# EAGLE design untitled (EAGLE 8.3.1)
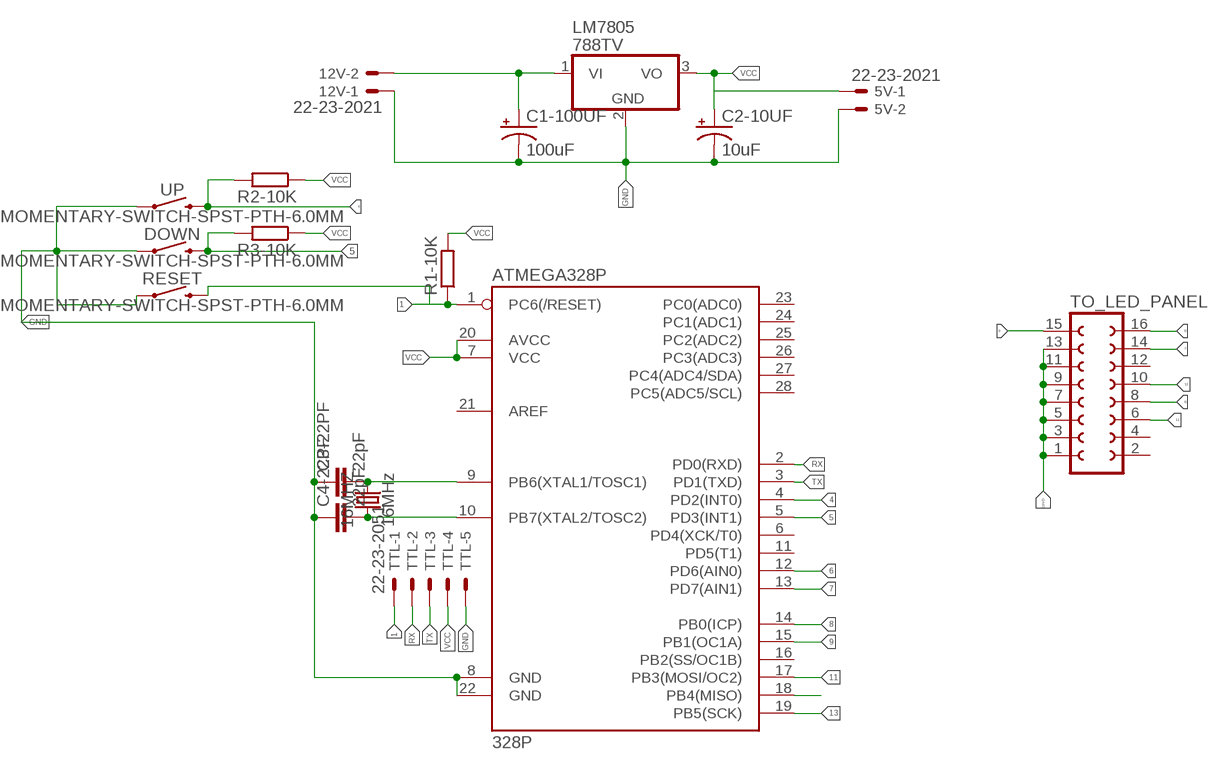
[diagram p0: schematic, sheet 1]

## Parts
5V  22-23-2021  [22-23-2021]
12V  22-23-2021  [22-23-2021]
16MHZ  16MHz  CRYSTAL-16MHZPTH-HC49US  [HC49US]
ATMEGA328P  328P  ATMEGA328P_PDIP  [DIP28]
C1-100UF  100uF  100UF-POLAR-RADIAL-2.5MM-25V-20%  [CPOL-RADIAL-2.5MM-6.5MM]
C2-10UF  10uF  10UF-POLAR-RADIAL-2.5MM-25V-20%  [CPOL-RADIAL-2.5MM-5MM]
C3-22PF  22pF  22PF-PTH-2.54MM-200V-5%  [CAP-PTH-2.54]
C4-22PF  22pF  22PF-PTH-2.54MM-200V-5%  [CAP-PTH-2.54]
DOWN  MOMENTARY-SWITCH-SPST-PTH-6.0MM  [TACTILE_SWITCH_PTH_6.0MM]
LM7805  788TV  [TO220V]
R1-10K  R-EU_0207/10  [0207/10]
R2-10K  R-EU_0207/10  [0207/10]
R3-10K  R-EU_0207/10  [0207/10]
RESET  MOMENTARY-SWITCH-SPST-PTH-6.0MM  [TACTILE_SWITCH_PTH_6.0MM]
TO_LED_PANEL  FE08-2  [FE08-2]
TTL  22-23-2051  [22-23-2051]
UP  MOMENTARY-SWITCH-SPST-PTH-6.0MM  [TACTILE_SWITCH_PTH_6.0MM]

## Nets
1: ATMEGA328P.1(PC6(/RESET)) R1-10K.1 RESET.3 TTL.1
4: ATMEGA328P.4(PD2(INT0)) R2-10K.2 UP.3
5: ATMEGA328P.5(PD3(INT1)) DOWN.3 R3-10K.2
6: ATMEGA328P.12(PD6(AIN0)) TO_LED_PANEL.16
7: ATMEGA328P.13(PD7(AIN1)) TO_LED_PANEL.14
8: ATMEGA328P.14(PB0(ICP)) TO_LED_PANEL.8
9: ATMEGA328P.15(PB1(OC1A)) TO_LED_PANEL.15
11: ATMEGA328P.17(PB3(MOSI/OC2)) TO_LED_PANEL.6
13: ATMEGA328P.19(PB5(SCK)) TO_LED_PANEL.10
GND: 5V.2 12V.1 ATMEGA328P.8(GND) ATMEGA328P.22(GND) C1-100UF.2(-) C2-10UF.2(-) C3-22PF.1 C4-22PF.1 DOWN.1 LM7805.2(GND) RESET.1 TO_LED_PANEL.1 TO_LED_PANEL.3 TO_LED_PANEL.5 TO_LED_PANEL.7 TO_LED_PANEL.9 TO_LED_PANEL.11 TO_LED_PANEL.13 TTL.5 UP.1
N$1: 16MHZ.2 ATMEGA328P.9(PB6(XTAL1/TOSC1)) C3-22PF.2
N$2: 16MHZ.1 ATMEGA328P.10(PB7(XTAL2/TOSC2)) C4-22PF.2
N$6: ATMEGA328P.18(PB4(MISO))
RX: ATMEGA328P.2(PD0(RXD)) TTL.2
TX: ATMEGA328P.3(PD1(TXD)) TTL.3
VCC: 5V.1 ATMEGA328P.7(VCC) ATMEGA328P.20(AVCC) C2-10UF.1(+) LM7805.3(VO) R1-10K.2 R2-10K.1 R3-10K.1 TTL.4
VIN: 12V.2 C1-100UF.1(+) LM7805.1(VI)
Unconnected: ATMEGA328P.6(PD4(XCK/T0)) ATMEGA328P.11(PD5(T1)) ATMEGA328P.16(PB2(SS/OC1B)) ATMEGA328P.21(AREF) ATMEGA328P.23(PC0(ADC0)) ATMEGA328P.24(PC1(ADC1)) ATMEGA328P.25(PC2(ADC2)) ATMEGA328P.26(PC3(ADC3)) ATMEGA328P.27(PC4(ADC4/SDA)) ATMEGA328P.28(PC5(ADC5/SCL)) TO_LED_PANEL.2 TO_LED_PANEL.4 TO_LED_PANEL.12

## Library data of the parts
5V 12V = con-molex:22-23-2021: .100" (2.54mm) Center Header - 2 Pin
16MHZ = SparkFun-Clocks:CRYSTAL-16MHZ: 16MHz Crystal Digikey Example <http://www.digikey.com/product-search/en?keywords=535-9122-1-ND> Frequency: 16MHz Frequency Stability: ±50ppm Frequency Tolerance: ±20ppm Load Capacitance: 18pF SparkFun Products: Pro Micro -5V/16MHz <https://www.sparkfun.com/products/12640> SparkFun Serial Enabled LCD Kit <https://www.sparkfun.com/products/10097>; PROD_ID: XTAL-08181; SF_ID: COM-00536
ATMEGA328P = SparkFun-IC-Microcontroller:ATMEGA328P_PDIP: Atmel 328P Through hole ATMEGA328P uC used in the Arduino 32kb flash, 1k EEPROM, 2k SRAM Datasheet <http://www.sparkfun.com/datasheets/Components/SMD/ATMega328.pdf> SparkFun Products Storefront component: AVR 28 Pin 20MHz 32K 6A/D - ATMega328P <https://www.sparkfun.com/products/9061> (COM-09061) SparkFun Simon Says - Through-Hole Soldering Kit <https://www.sparkfun.com/products/10547> (KIT-10547) SparkFun Learn to Solder - Simon Says <https://www.sparkfun.com/products/13708> (KIT-13708) SparkFun BigTime Watch Kit <https://www.sparkfun.com/products/11734> (KIT-11734) SparkFun ClockIt <https://www.sparkfun.com/products/10930> (KIT-10930) SparkFun Serial Enabled LCD Kit <https://www.sparkfun.com/products/10097> (LCD-10097) SparkFun Simon Tilts - Through Hole Soldering Kit <https://www.sparkfun.com/products/12634> (KIT-12634) SparkFun Frequency Counter Kit <https://www.sparkfun.com/products/10140> (KIT-10140) FabFM Radio Kit <https://www.sparkfun.com/products/11043> (KIT-11043) SparkFun Binary Blaster Kit <https://www.sparkfun.com/products/12037> (KIT-12037) SparkFun Metro-Gnome <https://www.sparkfun.com/products/9236> (KIT-09236) ATmega328 with Arduino Optiboot (Uno) <https://www.sparkfun.com/products/10524> (DEV-10524); PROD_ID: IC-09136
C1-100UF = SparkFun-Capacitors:100UF-POLAR: 100µF polarized capacitors A capacitor is a passive two-terminal electrical component used to store electrical energy temporarily in an electric field.; PROD_ID: CAP-08439
C2-10UF = SparkFun-Capacitors:10UF-POLAR: 10.0µF polarized capacitors A capacitor is a passive two-terminal electrical component used to store electrical energy temporarily in an electric field.; PROD_ID: CAP-08440
C3-22PF C4-22PF = SparkFun-Capacitors:22PF: 22pF ceramic capacitors A capacitor is a passive two-terminal electrical component used to store electrical energy temporarily in an electric field.; PROD_ID: CAP-09128
DOWN RESET UP = SparkFun-Switches:MOMENTARY-SWITCH-SPST: Momentary Switch (Pushbutton) - SPST Normally-open (NO) SPST momentary switches (buttons, pushbuttons). Variants PTH-12MM - 12mm square, through-hole Momentary Pushbutton Switch - 12mm Square <https://www.sparkfun.com/products/9190> (COM-09190) PTH-6.0MM, PTH-6.0MM-KIT - 6.0mm square, through-hole Mini Pushbutton Switch <https://www.sparkfun.com/products/97> (COM-00097) KIT package intended for soldering kit's - only one side of pads' copper is exposed. PTH-RIGHT-ANGLE-KIT - Right-angle, through-hole Right Angle Tactile Button <https://www.sparkfun.com/products/10791> - Used on SparkFun BigTime Watch Kit <https://www.sparkfun.com/products/11734> SMD-12MM - 12mm square, surface-mount Tactile Button - SMD (12mm) <https://www.sparkfun.com/products/12993> (COM-12993) Used on SparkFun PicoBoard <https://www.sparkfun.com/products/11888> SMD-4.5MM - 4.5mm Square Trackball Switch Used on SparkFun Blackberry Trackballer Breakout <https://www.sparkfun.com/products/13169> SMD-4.6MMX2.8MM - 4.60mm x 2.80mm, surface mount Used on SparkFun SAMD21 Mini Breakout <https://www.sparkfun.com/products/13664> SMD-5.2MM, SMD-5.2-REDUNDANT - 5.2mm square, surface-mount Mini Pushbutton Switch - SMD <https://www.sparkfun.com/products/8720> (COM-08720) Used on Arduino Pro Mini <https://www.sparkfun.com/products/11114> REDUNDANT package connects both switch circuits together SMD-6.0X3.5MM - 6.0 x 3.5mm, surface mount Momentary Reset Switch SMD <https://www.sparkfun.com/products/8229> (COM-08229) SMD-6.2MM-TALL - 6.2mm square, surface mount Tactile Button - SMD (6mm) <https://www.sparkfun.com/products/12992> Used on SparkFun Digital Sandbox <https://www.sparkfun.com/products/12651> SMD-RIGHT-ANGLE - Right-angle, surface mount Used on SparkFun Block for Intel® Edison - Arduino <https://www.sparkfun.com/products/13036>; PROD_ID: SWCH-08441; SF_SKU: COM-00097
LM7805 = linear:78*: Positive VOLTAGE REGULATOR Source: http://cache.national.com/ds/LM/LM78L05.pdf http://www.fairchildsemi.com/ds/LM/LM7805.pdf
R1-10K R2-10K R3-10K = rcl:R-EU_: RESISTOR, European symbol
TO_LED_PANEL = con-lsta:FE08-2: FEMALE HEADER
TTL = con-molex:22-23-2051: .100" (2.54mm) Center Header - 5 Pin

## Board
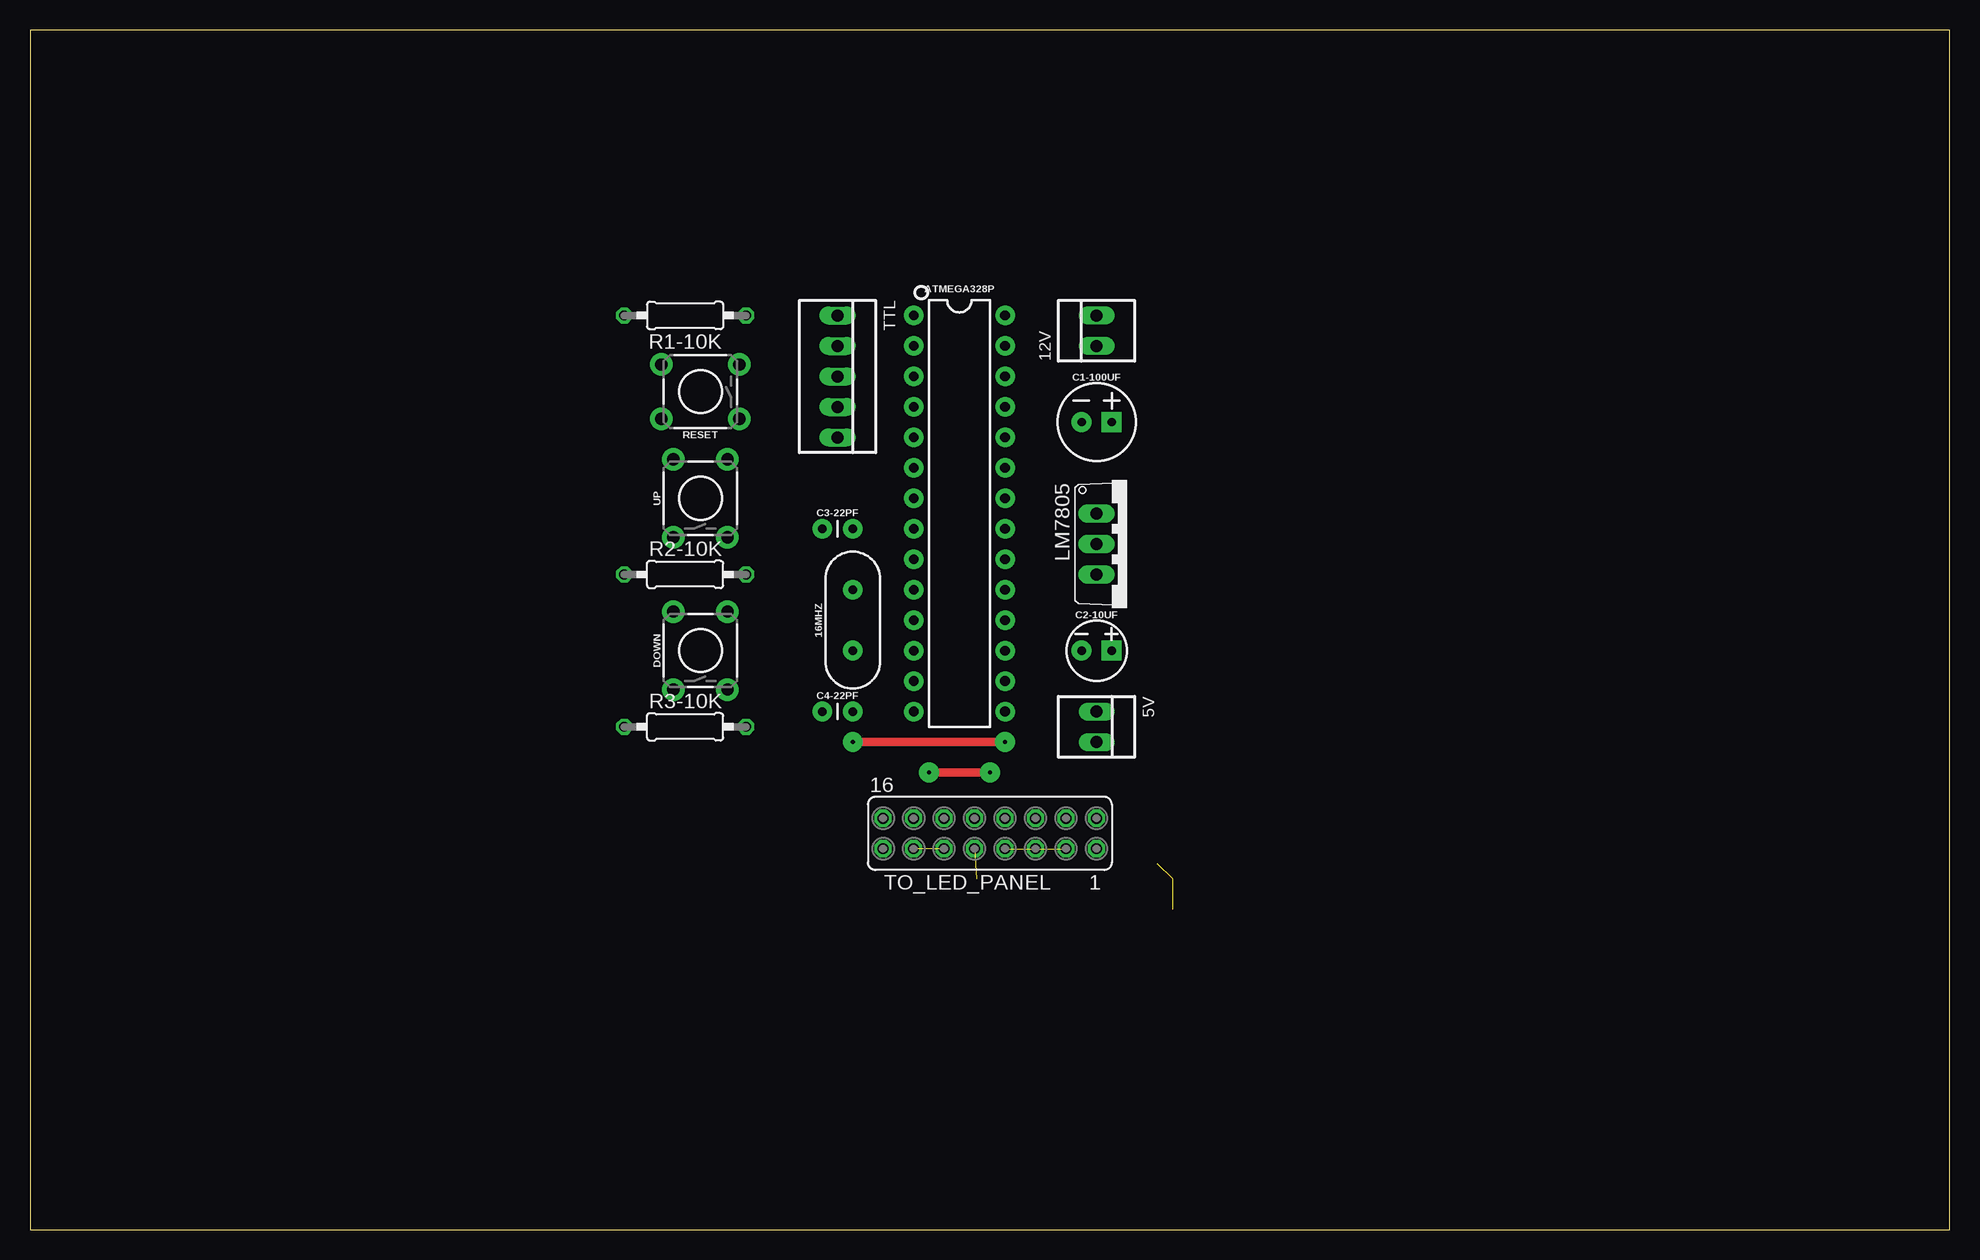
[diagram p1: board, top side]
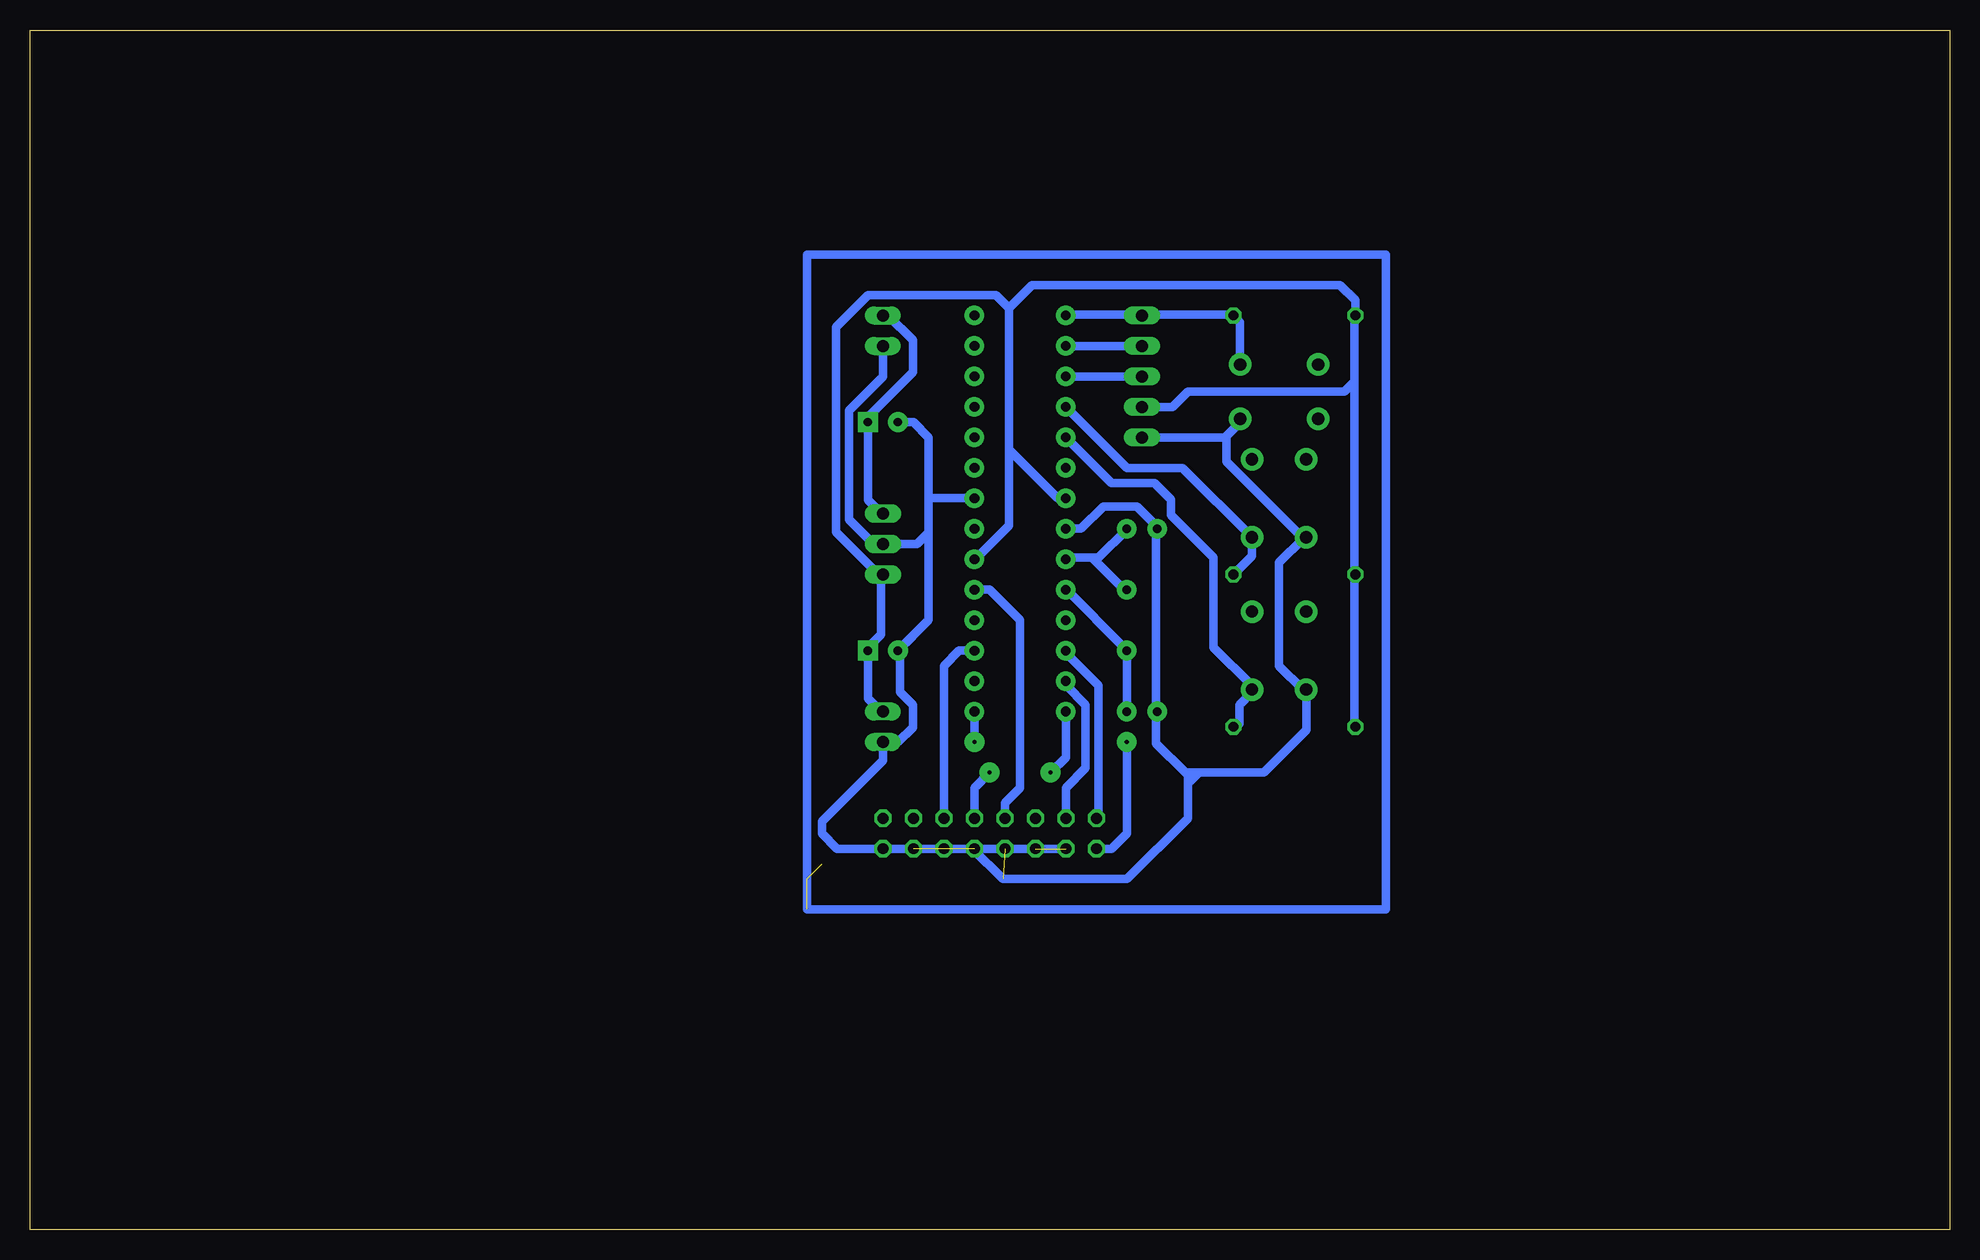
[diagram p2: board, bottom side, seen from below]

Size 160 x 100 mm. Coordinates in mm from the lower left corner, seen from the top.
Outline: 0,0 160,0 160,100 0,100 0,0
Copper layers (1*16): Top 0.035mm / dielectric 1.5mm / Bottom 0.035mm
Design rules "default *": minimum track width 28mil, minimum drill 0.35mm, track to track 14mil, track to pad 8mil, pad to pad 6mil, via to via 6mil, smd to smd 6mil, copper to edge 40mil, drill to drill 6mil, minimum pad ring 10mil, minimum via ring 8mil, stop-mask expansion 4mil, vias tented up to drill 0mil, thermal gap 10mil

### Footprints (pad centres in the part's own frame; a part is rotated, then mirrored left to right if it is on the bottom)
22-23-2021 = drill 1 long: 1 -1.27,0; 2 1.27,0
HC49US = drill 0.7 pad 1.651: 1 -2.54,0; 2 2.54,0
DIP28 = drill 0.813 pad 1.626: 1 -16.51,-3.81; 2 -13.97,-3.81; 3 -11.43,-3.81; 4 -8.89,-3.81; 5 -6.35,-3.81; 6 -3.81,-3.81; 7 -1.27,-3.81; 8 1.27,-3.81; 9 3.81,-3.81; 10 6.35,-3.81; 11 8.89,-3.81; 12 11.43,-3.81; 13 13.97,-3.81; 14 16.51,-3.81; 15 16.51,3.81; 16 13.97,3.81; 17 11.43,3.81; 18 8.89,3.81; 19 6.35,3.81; 20 3.81,3.81; 21 1.27,3.81; 22 -1.27,3.81; 23 -3.81,3.81; 24 -6.35,3.81; 25 -8.89,3.81; 26 -11.43,3.81; 27 -13.97,3.81; 28 -16.51,3.81
CPOL-RADIAL-2.5MM-6.5MM = drill 0.7 pad 1.651 square: 1 1.25,0 | drill 0.7 pad 1.651: 2 -1.25,0
CPOL-RADIAL-2.5MM-5MM = drill 0.7 pad 1.651 square: 1 1.25,0 | drill 0.7 pad 1.651: 2 -1.25,0
CAP-PTH-2.54 = drill 0.7 pad 1.651: 1 -1.27,0; 2 1.27,0
TACTILE_SWITCH_PTH_6.0MM = drill 1.016 pad 1.88: 1 -3.251,2.261; 2 3.251,2.261; 3 -3.251,-2.261; 4 3.251,-2.261
TO220V = drill 1.016 long: 1 -2.54,-2.54; 2 0,-2.54; 3 2.54,-2.54
0207/10 = drill 0.813 octagon: 1 -5.08,0; 2 5.08,0
FE08-2 = drill 0.914 octagon: 1 -8.89,1.27; 2 -8.89,-1.27; 3 -6.35,1.27; 4 -6.35,-1.27; 5 -3.81,1.27; 6 -3.81,-1.27; 7 -1.27,1.27; 8 -1.27,-1.27; 9 1.27,1.27; 10 1.27,-1.27; 11 3.81,1.27; 12 3.81,-1.27; 13 6.35,1.27; 14 6.35,-1.27; 15 8.89,1.27; 16 8.89,-1.27
22-23-2051 = drill 1 long: 1 -5.08,0; 2 -2.54,0; 3 0,0; 4 2.54,0; 5 5.08,0

### Placement (x,y rotation side)
5V  88.9,41.91 270 top
12V  88.9,74.93 90 top
16MHZ  68.58,50.8 90 top
ATMEGA328P  77.47,59.69 270 top
C1-100UF  88.9,67.31 0 top
C2-10UF  88.9,48.26 0 top
C3-22PF  67.31,58.42 0 top
C4-22PF  67.31,43.18 0 top
DOWN  55.88,48.26 90 top
LM7805  91.44,57.15 270 top
R1-10K  54.61,76.2 180 top
R2-10K  54.61,54.61 0 top
R3-10K  54.61,41.91 0 top
RESET  55.88,69.85 180 top
TO_LED_PANEL  80.01,33.02 180 top
TTL  67.31,71.12 270 top
UP  55.88,60.96 90 top

### Tracks (layer width: path | path; a pad name or v marks a point on that pad's centre or on a via)
1
  Bottom 0.711: ATMEGA328P.1 73.61,76.28 67.74,76.28 TTL.1 67.21,76.28 59.74,76.28 R1-10K.1 59.32,75.85 59.13,75.66 RESET.3
4
  Bottom 0.711: ATMEGA328P.4 68.58,63.5 63.93,63.5 UP.3 58.14,56.16 R2-10K.2
5
  Bottom 0.711: R3-10K.2 59.21,42.14 59.21,43.74 58.14,44.81 DOWN.3 58.14,45.34 61.34,48.54 61.34,56.01 64.9,59.56 64.9,60.85 66.28,62.23 69.85,62.23 ATMEGA328P.5
6
  Bottom 0.711: ATMEGA328P.12 73.66,48.06 70.94,45.34 70.94,34.47 TO_LED_PANEL.16
7
  Bottom 0.711: ATMEGA328P.13 73.61,45.34 72.01,43.74 72.01,38.48 73.66,36.83 TO_LED_PANEL.14
8  (via drill 0.35 pad 1.65)
  Top 0.711: v74.93,38.1 v80.01,38.1
  Bottom 0.711: TO_LED_PANEL.8 81.28,36.83 v80.01,38.1 | ATMEGA328P.14 73.66,39.37 v74.93,38.1
9  (via drill 0.35 pad 1.65)
  Top 0.711: v68.58,40.64 v81.28,40.64
  Bottom 0.711: TO_LED_PANEL.15 69.85,31.75 68.58,33.02 v68.58,40.64 | v81.28,40.64 ATMEGA328P.15
11
  Bottom 0.711: ATMEGA328P.17 82.55,48.26 83.82,46.99 TO_LED_PANEL.6
13
  Bottom 0.711: ATMEGA328P.19 80.01,53.34 77.47,50.8 77.47,36.83 78.74,35.56 TO_LED_PANEL.10
GND  (5 unrouted)
  Bottom 0.711: 60.27,66.14 59.21,67.21 RESET.1 | 60.27,66.14 60.27,64.01 53.87,57.61 | 53.87,57.61 UP.1 | C2-10UF.2 87.48,48.01 87.48,44.81 86.41,43.74 86.41,41.86 87.63,40.64 5V.2 88.9,39.12 93.98,34.04 93.98,33.02 92.71,31.75 TO_LED_PANEL.1 81.43,31.75 | 88.54,57.07 LM7805.2 | 63.7,38.1 66.14,40.54 66.14,42.67 C4-22PF.1 66.14,43.2 66.14,58.14 C3-22PF.1 66.14,58.67 67.74,60.27 70.54,60.27 72.39,58.42 ATMEGA328P.8 | 62.58,38.1 57.15,38.1 53.62,41.63 DOWN.1 53.9,45.01 55.88,46.99 55.88,55.6 53.87,57.61 | 62.58,38.1 63.7,38.1 | TTL.5 60.38,66.04 60.27,66.14 | 12V.1 88.9,71.12 91.75,68.28 91.75,59.21 89.69,57.15 LM7805.2 | 63.5,37.18 63.5,34.29 68.58,29.21 78.89,29.21 81.43,31.75 | 63.5,37.18 63.5,37.9 63.7,38.1 | 62.58,38.1 63.5,37.18 | 81.43,31.75 TO_LED_PANEL.13 | 86.41,49.5 C2-10UF.2 | C1-100UF.2 86.36,67.31 85.09,66.04 85.09,60.96 | 85.09,60.96 ATMEGA328P.22 | 85.09,58.11 85.09,60.96 | 85.09,58.11 85.09,50.82 C2-10UF.2 | LM7805.2 86.05,57.15 85.09,58.11
N$1
  Bottom 0.711: 71.48,56.01 70.94,56.01 68.58,58.37 C3-22PF.2 | 71.48,56.01 73.61,56.01 ATMEGA328P.9 | 71.48,56.01 68.81,53.34 16MHZ.2
N$2
  Bottom 0.711: ATMEGA328P.10 73.61,53.34 68.81,48.54 16MHZ.1 C4-22PF.2
N$3  (2 unrouted)
  Bottom 0.711: 46.99,29.21 46.99,81.28 95.25,81.28 95.25,26.67 46.99,26.67 46.99,30.48
RX
  Bottom 0.711: TTL.2 ATMEGA328P.2
TX
  Bottom 0.711: TTL.3 ATMEGA328P.3
VCC
  Bottom 0.711: 5V.1 89.08,43.2 90.14,44.27 90.14,48.01 C2-10UF.1 90.14,48.54 89.08,49.61 89.08,54.41 LM7805.3 89.28,54.61 92.81,58.14 92.81,75.21 90.14,77.88 79.48,77.88 78.41,76.81 | R3-10K.1 49.61,42.14 49.61,54.41 R2-10K.1 49.61,54.94 49.61,70.7 | 49.61,70.7 49.61,75.74 R1-10K.2 49.53,77.47 50.8,78.74 76.48,78.74 78.41,76.81 | 78.41,76.81 78.41,65.02 | 78.41,65.02 78.41,58.67 81.08,56.01 ATMEGA328P.20 | TTL.4 64.77,68.58 63.5,69.85 58.42,69.85 | 57.92,69.85 58.42,69.85 | 58.42,69.85 50.45,69.85 49.61,70.7 | ATMEGA328P.7 74.36,60.96 78.41,65.02
VIN
  Bottom 0.711: LM7805.1 89.08,59.74 90.14,60.81 90.14,67.21 C1-100UF.1 90.14,67.74 86.41,71.48 86.41,74.14 88.47,76.2 12V.2